# EasyEDA Pro project Stm32Printer.eprj, board PCB4_6
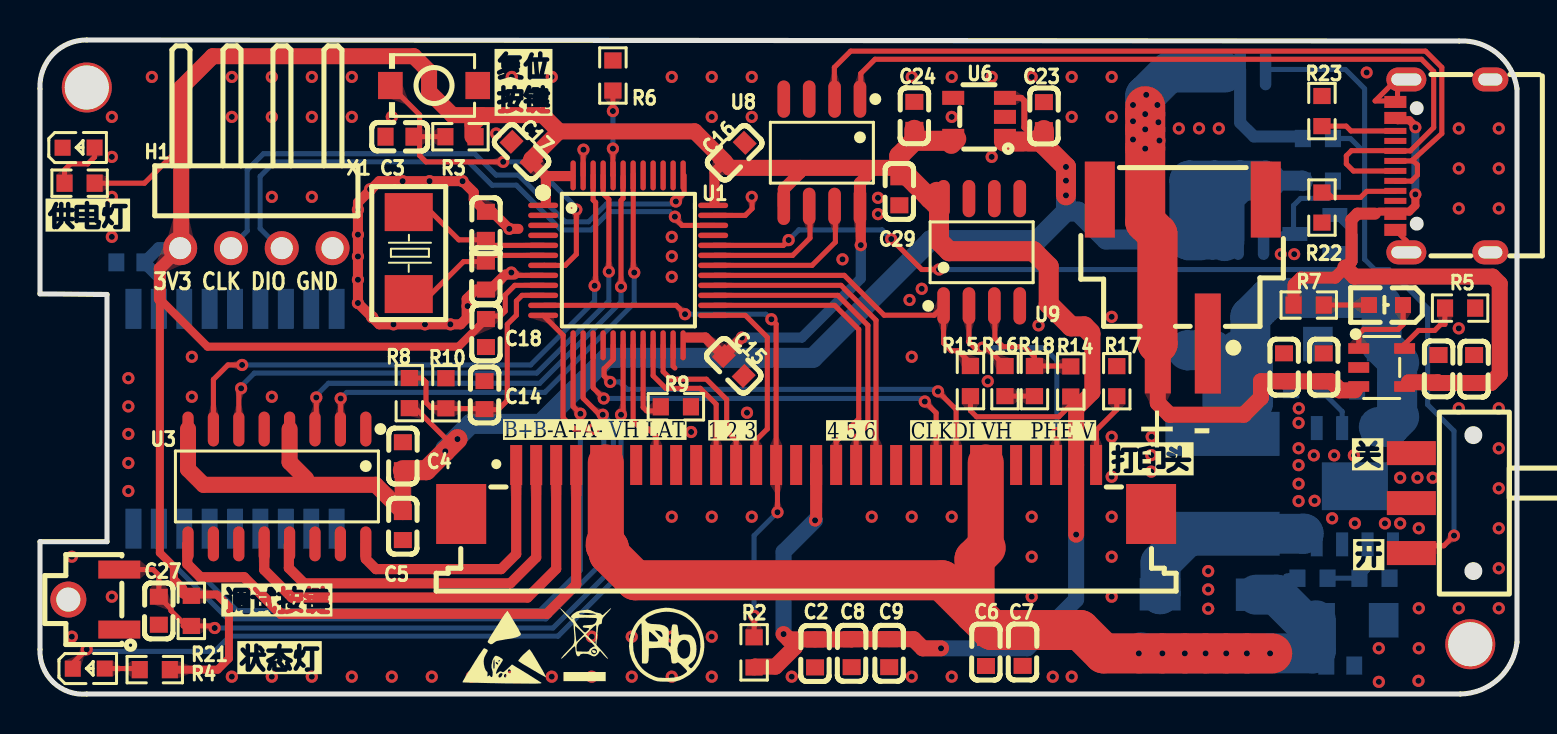
[diagram p2: board, top side]
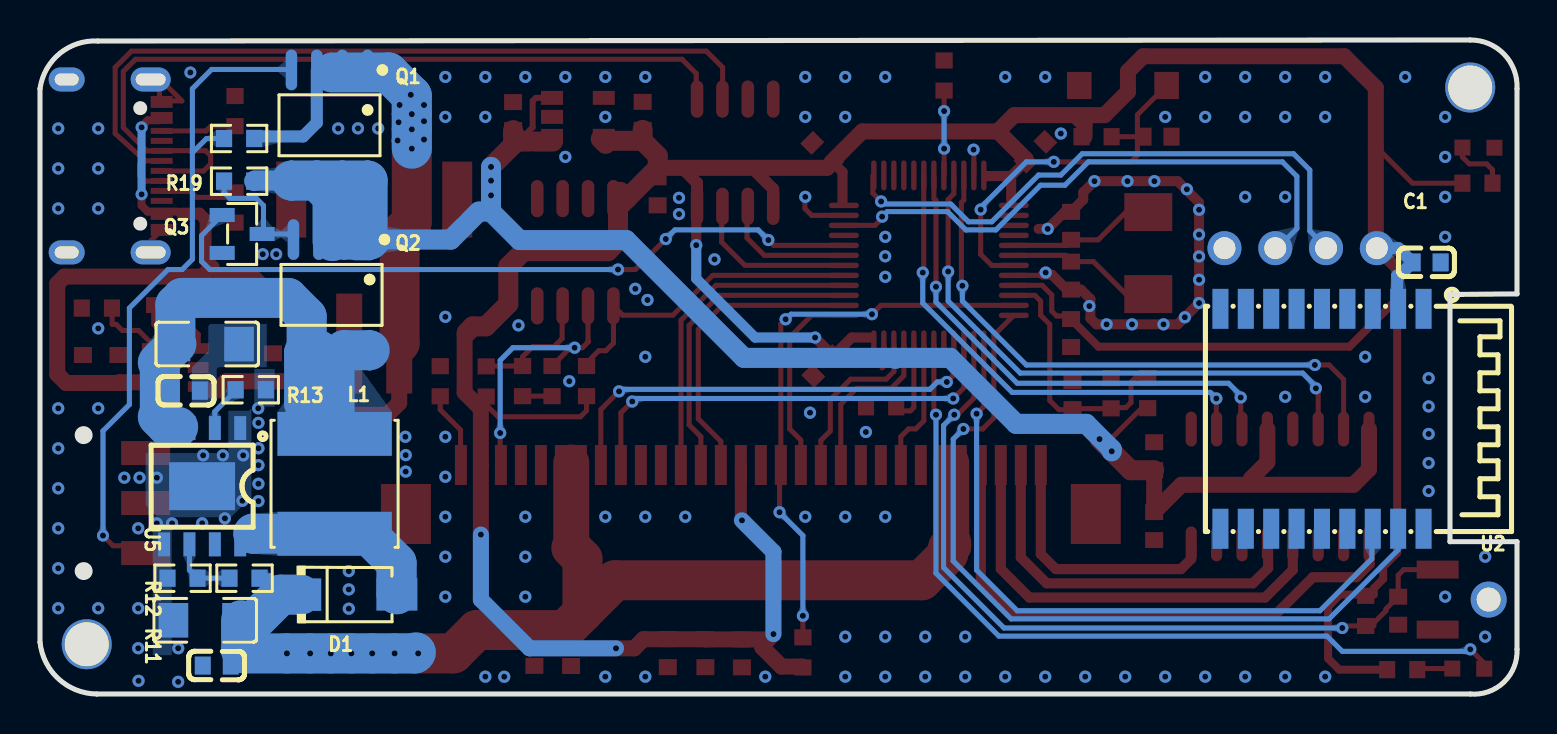
[diagram p3: board, bottom side, seen from below]

Outline 73.86 x 32.72 mm; copper layers: Top Layer, Bottom Layer. Coordinates in mm from the lower left corner of the outline.
Outline path: 0,30.28 0,20.02 3.35,19.98 3.35,7.62 0,7.62 0,2.24 arc(0.66,0.59) 2.34,0 71.02,0 arc(72.93,0.75) 73.86,2.59 73.86,30.28 arc(72.88,32.04) 70.97,32.66 2.35,32.72 arc(0.65,32) 0,30.28
Stack: Top Layer 0.035mm / Dielectric1 1.51mm FR4 er 4.5 / Bottom Layer 0.035mm

## Design rules (mm)
spacing safeClearance (default): track to track 0.127, other pairs 0.152 to 0.3
track width trackWidth (default): min 0.127, default 0.254, max 2.54
differential pair differentialPair (default): width min 0.127, default 0.254, max 2.54; gap min 0.152, default 0.152
via viaSize (default): diameter min 0.5, default 0.61, max 10; hole min 0.3, default 0.305, max 6

## Placement (name value [footprint] x y rotation side)
C1  0.1uF  [c0603]  4.52 21.59 180 bottom
C2  100nF  [C0603]  38.76 2.03 90 top
C3  0.1uF  [c0603]  17.98 27.88 180 top
C4  10uF  [C0603]  18.15 11.9 270 top
C5  100nF  [C0603]  18.15 8.4 90 top
C6  4.7uF  [C0603]  47.31 2.1 90 top
C7  100nF  [C0603]  49.14 2.11 90 top
C8  4.7uF  [C0603]  40.59 2.04 90 top
C9  100nF  [C0603]  42.47 2.04 90 top
C10  10uF  [C0603]  69.94 16.26 270 top
C11  0.1uF  [c0603]  71.72 16.26 90 top
C12  0.1uF  [c0603]  64.19 16.34 270 top
C13  10uF  [C0603]  62.21 16.34 270 top
C14  100nF  [C0603]  22.23 14.95 270 top
C15  0.1uF  [c0603]  34.7 16.41 315 top
C16  0.1uF  [c0603]  34.75 27.08 45 top
C17  0.1uF  [c0603]  24.08 27.13 135 top
C18  0.1uF  [c0603]  22.3 18.06 270 top
C19  47uF  [C1206]  65.5 17.51 0 bottom
C20  100nF  [C0603]  66.57 15.17 0 bottom
C21  47uF  [C1206]  65.6 3.69 180 bottom
C22  100nF  [C0603]  65.02 1.42 180 bottom
C23  1uF  [C0603]  50.2 28.91 270 top
C24  1uF  [C0603]  43.72 28.92 270 top
C25  20pF  [C0603]  22.3 23.42 270 top
C26  20pF  [C0603]  22.3 20.93 90 top
C27  100nF  [C0603]  5.94 4.17 90 top
C29  47uF  [C0603]  42.98 25.15 90 top
D1  SS54  [SMA_L4.3-W2.6-LS5.0-RD]  58.42 4.98 180 bottom
FPC1  XH-2PWB  [CONN-SMD_2P-P2.50_DEALON_XH-2PWB_C2905024]  57.15 21.13 180 top
FPC2  X10B25L30T  [FPC-SMD_X10B25U30T]  38.31 10.23 0 top
H1  PZ254-1-04-W-8.5  [HDR-TH_04P-P2.54-H-M-W10.4-N]  10.82 22.3 180 top
L1  4.7uH  [IND-SMD_L6.0-W6.0]  59.13 10.52 270 bottom
LED1  NCD0603R1  [LED0603-RD_RED]  1.93 27.33 0 top
LED2  TLMG1100-GS08  [LED0603-R-RD_GREEN]  67.31 19.46 180 top
LED3  NCD0603R1  [LED0603-RD_RED]  2.44 1.27 0 top
NOREF  -  [Pad_e221]  71.53 2.49 0 top
NOREF#2  -  [Pad_e104]  2.34 30.34 0 top
Q1  AO4407A  [SOP-8_L5.0-W4.0-P1.27-LS6.0-BL]  59.38 28.45 0 bottom
Q2  AO4407A  [SOP-8_L5.0-W4.0-P1.27-LS6.0-BL]  59.28 19.96 0 bottom
Q3  AO3400A_N  [SOT-23-3_L2.9-W1.3-P1.90-LS2.4-BR]  63.75 23.01 0 bottom
R1  1kΩ  [R0603]  1.98 25.55 180 top
R2  10kΩ  [R0603]  35.71 2.08 270 top
R3  10kΩ  [r0603]  21.03 27.88 0 top
R4  1kΩ  [R0603]  5.74 1.22 180 top
R5  2kΩ  [R0603]  71.02 19.3 180 top
R6  10kΩ  [r0603]  28.65 30.94 90 top
R7  1kΩ  [R0603]  63.45 19.46 0 top
R8  10kΩ  [R0603]  18.47 15.05 270 top
R9  10kΩ  [r0603]  31.8 14.37 0 top
R10  10kΩ  [R0603]  20.3 15.04 270 top
R11  11kΩ  [R0603]  63.64 5.79 180 bottom
R12  1kΩ  [R0603]  66.73 5.79 180 bottom
R13  33kΩ  [R0603]  63.32 15.22 0 bottom
R14  56kΩ  [R0603]  51.55 15.63 270 top
R15  10kΩ  [R0603]  46.53 15.65 90 top
R16  15kΩ  [R0603]  48.26 15.65 90 top
R17  180Ω  [R0603]  53.85 15.65 90 top
R18  24kΩ  [R0603]  49.73 15.65 90 top
R19  100kΩ  [R0603]  63.91 25.65 180 bottom
R20  100kΩ  [R0603]  63.91 27.79 180 bottom
R21  10kΩ  [R0603]  7.57 4.16 270 top
R22  5.1kΩ  [R0603]  64.11 24.33 90 top
R23  5.1kΩ  [R0603]  64.11 29.16 90 top
SW1  TS-1088-AR02016  [SW-SMD_L3.9-W3.0-P4.45]  19.71 30.44 180 top
SW2  TA-3525-A3  [SW-SMD_3P-L9.1-W3.5-P2.50-EH6.8]  68.58 9.55 90 top
SW3  TS4538B3JTP 250gf 121  [KEY-SMD_3P-L4.5-W3.8-P3.00-LS4.5-BL]  2.69 4.72 90 top
U1  STM32F103CBT6  [LQFP-48_L7.0-W7.0-P0.50-LS9.0-BL]  29.41 21.69 270 top
U2  RC6621A  [BULETM-SMD_18P-L15.2-W11.2-P1.27]  9.75 13.77 270 bottom
U3  TC1508S  [SOP-16_L10.0-W3.9-P1.27-LS6.0-BL]  11.85 10.38 180 top
U4  ME4054BM5G-N  [TSOT-23-5_L2.9-W1.6-P0.95-LS2.8-BL]  67.1 16.33 270 top
U5  AP2005SPER  [ESOP-8_L4.9-W3.9-P1.27-LS6.0-BL-EP]  65.75 10.39 0 bottom
U6  XC6210B332MR  [TSOT-23-5_L2.9-W1.6-P0.95-LS2.8-BR]  46.96 28.87 0 top
U8  CH340N  [SOP-8_L4.9-W3.9-P1.27-LS6.0-BL]  39.1 27.08 180 top
U9  LM393ADR  [SOP-8_L4.9-W3.9-P1.27-LS6.0-BL]  47.09 22.1 0 top
USB1  TYPE-C 16PIN 2MD(073)  [USB-C-SMD_TYPE-C-6PIN-2MD-073]  70.15 26.42 90 top
X1  8MHz  [CRYSTAL-SMD_L5.0-W3.2]  18.44 22.06 90 top

## Footprints (pads in the part's own frame, mm; a bottom-side part is the same pattern mirrored in y, then rotated)
BULETM-SMD_18P-L15.2-W11.2-P1.27
  rect 2x0.8 smd: 1(-5.5,5.08) 2(-5.5,3.81) 3(-5.5,2.54) 4(-5.5,1.27) 5(-5.5,0) 6(-5.5,-1.27) 7(-5.5,-2.54) 8(-5.5,-3.81) 9(-5.5,-5.08) 10(5.5,-5.08) 11(5.5,-3.81) 12(5.5,-2.54) 13(5.5,-1.27) 14(5.5,0) 15(5.5,1.27) 16(5.5,2.54) 17(5.5,3.81) 18(5.5,5.08)
C0603
  rect 0.8x0.9 smd: 1(-0.7,0) 2(0.7,0)
c0603
  rect 0.8x0.9 smd: 1(-0.7,0) 2(0.7,0)
C1206
  rect 1.485x1.728 smd: 1(-1.593,0) 2(1.593,0)
CONN-SMD_2P-P2.50_DEALON_XH-2PWB_C2905024
  rect 1.3x5 smd: 1(-1.25,3.6) 2(1.25,3.6)
  rect 1.5x3.8 smd: 3(-4.15,-3.6) 4(4.15,-3.6)
CRYSTAL-SMD_L5.0-W3.2
  rect 1.9x2.4 smd: 1(-2.05,0) 2(2.05,0)
ESOP-8_L4.9-W3.9-P1.27-LS6.0-BL-EP
  rect 0.6x1.2 smd: 1(-1.905,-2.909) 2(-0.635,-2.909) 3(0.635,-2.909) 4(1.905,-2.909) 5(1.905,2.909) 6(0.635,2.909) 7(-0.635,2.909) 8(-1.905,2.909)
  rect 3.3x2.4 smd: 9(0,0)
FPC-SMD_X10B25U30T
  rect 0.6x2 smd: 1(-14.5,1.225) 2(-13.5,1.225) 3(-12.5,1.225) 4(-11.5,1.225) 5(-10.5,1.225) 6(-9.5,1.225) 7(-8.5,1.225) 8(-7.5,1.225) 9(-6.5,1.225) 10(-5.5,1.225) 11(-4.5,1.225) 12(-3.5,1.225) 13(-2.5,1.225) 14(-1.5,1.225) 15(-0.5,1.225) 16(0.5,1.225) 17(1.5,1.225) 18(2.5,1.225) 19(3.5,1.225) 20(4.5,1.225) 21(5.5,1.225) 22(6.5,1.225) 23(7.5,1.225) 24(8.5,1.225) 25(9.5,1.225) 26(10.5,1.225) 27(11.5,1.225) 28(12.5,1.225) 29(13.5,1.225) 30(14.5,1.225)
  rect 2.5x3 smd: 31(17.25,-1.225) 32(-17.25,-1.225)
HDR-TH_04P-P2.54-H-M-W10.4-N
  round 1.7 hole 1.1: 1(-3.81,0) 2(-1.27,0) 3(1.27,0) 4(3.81,0)
IND-SMD_L6.0-W6.0
  rect 2.2x5.72 smd: 1(-2.5,0) 2(2.5,0)
KEY-SMD_3P-L4.5-W3.8-P3.00-LS4.5-BL
  rect 0.9x2.1 smd: 1(-1.5,-1.274) 2(1.5,-1.274)
  round 1.8 hole 1.2: 3(0,1.274)
LED0603-R-RD_GREEN
  rect 0.8x0.8 smd: 1(0.851,0) 2(-0.851,0)
LED0603-RD_RED
  rect 0.8x0.8 smd: 1(-0.799,-0.004) 2(0.799,0.004)
LQFP-48_L7.0-W7.0-P0.50-LS9.0-BL
  oval 0.27x1.5 smd: 1(-2.75,-4.25) 2(-2.25,-4.25) 3(-1.75,-4.25) 4(-1.25,-4.25) 5(-0.75,-4.25) 6(-0.25,-4.25) 7(0.25,-4.25) 8(0.75,-4.25) 9(1.25,-4.25) 10(1.75,-4.25) 11(2.25,-4.25) 12(2.75,-4.25) 25(2.75,4.25) 26(2.25,4.25) 27(1.75,4.25) 28(1.25,4.25) 29(0.75,4.25) 30(0.25,4.25) 31(-0.25,4.25) 32(-0.75,4.25) 33(-1.25,4.25) 34(-1.75,4.25) 35(-2.25,4.25) 36(-2.75,4.25)
  oval 1.5x0.27 smd: 13(4.25,-2.75) 14(4.25,-2.25) 15(4.25,-1.75) 16(4.25,-1.25) 17(4.25,-0.75) 18(4.25,-0.25) 19(4.25,0.25) 20(4.25,0.75) 21(4.25,1.25) 22(4.25,1.75) 23(4.25,2.25) 24(4.25,2.75) 37(-4.25,2.75) 38(-4.25,2.25) 39(-4.25,1.75) 40(-4.25,1.25) 41(-4.25,0.75) 42(-4.25,0.25) 43(-4.25,-0.25) 44(-4.25,-0.75) 45(-4.25,-1.25) 46(-4.25,-1.75) 47(-4.25,-2.25) 48(-4.25,-2.75)
Pad_e104
  round 2.5 hole 2.2: 25(0,0)
Pad_e221
  round 2.5 hole 2.2: 23(0,0)
R0603
  rect 0.806x0.864 smd: 1(-0.753,0) 2(0.753,0)
r0603
  rect 0.806x0.864 smd: 1(-0.753,0) 2(0.753,0)
SMA_L4.3-W2.6-LS5.0-RD
  rect 2.046x1.62 smd: 1(-2.404,-0.009) 2(2.404,0.009)
SOP-8_L4.9-W3.9-P1.27-LS6.0-BL
  oval 0.63x1.865 smd: 1(-1.905,-2.683) 2(-0.635,-2.683) 3(0.635,-2.683) 4(1.905,-2.683) 5(1.905,2.683) 6(0.635,2.683) 7(-0.635,2.683) 8(-1.905,2.683)
SOP-8_L5.0-W4.0-P1.27-LS6.0-BL
  oval 0.574x2.035 smd: 1(-1.905,-2.768) 2(-0.635,-2.768) 3(0.635,-2.768) 4(1.905,-2.768) 5(1.905,2.768) 6(0.635,2.768) 7(-0.635,2.768) 8(-1.905,2.768)
SOP-16_L10.0-W3.9-P1.27-LS6.0-BL
  oval 0.56x1.745 smd: 1(-4.445,-2.873) 2(-3.175,-2.873) 3(-1.905,-2.873) 4(-0.635,-2.873) 5(0.635,-2.873) 6(1.905,-2.873) 7(3.175,-2.873) 8(4.445,-2.873) 9(4.445,2.873) 10(3.175,2.873) 11(1.905,2.873) 12(0.635,2.873) 13(-0.635,2.873) 14(-1.905,2.873) 15(-3.175,2.873) 16(-4.445,2.873)
SOT-23-3_L2.9-W1.3-P1.90-LS2.4-BR
  rect 1.25x0.7 smd: 1(1,-0.95) 2(1,0.95) 3(-1,0)
SW-SMD_3P-L9.1-W3.5-P2.50-EH6.8
  rect 1.2x2.45 smd: 1(-2.5,0) 2(0,0) 3(2.5,0)
SW-SMD_L3.9-W3.0-P4.45
  rect 1.23x1.36 smd: 1(-2.185,0) 2(2.185,0)
TSOT-23-5_L2.9-W1.6-P0.95-LS2.8-BL
  rect 0.532x1.045 smd: 1(-0.95,-1.147) 2(0,-1.147) 3(0.95,-1.147) 4(0.95,1.147) 5(-0.95,1.147)
TSOT-23-5_L2.9-W1.6-P0.95-LS2.8-BR
  rect 1.1x0.7 smd: 1(1.294,-0.951) 2(1.294,-0.001) 3(1.294,0.951) 4(-1.294,0.951) 5(-1.294,-0.949)
USB-C-SMD_TYPE-C-6PIN-2MD-073
  rect 0.6x1.1 smd: 1(-3.2,2.375) 2(-2.4,2.375) 11(2.4,2.375) 12(3.2,2.375)
  rect 0.3x1.1 smd: 3(-1.75,2.375) 4(-1.25,2.375) 5(-0.75,2.375) 6(-0.25,2.375) 7(0.25,2.375) 8(0.75,2.375) 9(1.25,2.375) 10(1.75,2.375)
  oval 1.2x2 hole 0.6x1.5: 13(-4.325,1.825) 14(4.325,1.825)
  oval 1.2x1.8 hole 0.6x1.2: 13(-4.325,-2.375) 14(4.325,-2.375)

## Nets
As in the schematic.

Pads without a net: FPC1 3 4; FPC2 7 26 27 31 32; NOREF 23; NOREF#2 25; SW2 3; SW3 3; U1 2 3 4 16 33 38 39 40 41; U2 3 4 5 6 7 8 9 10 11 12 13 14 15 18; U3 1 5; U5 7; U6 4; U8 4; U9 5 6 7; USB1 3 9

## Via types
v1: diameter 0.61, hole 0.304, Top Layer to Bottom Layer, 106 vias
v2: diameter 0.61, hole 0.305, Top Layer to Bottom Layer, 95 vias
v3: diameter 0.6, hole 0.305, Top Layer to Bottom Layer, 26 vias

## Routing (per net, layer and track width the routed paths; a pad name or vN(x,y) marks a point on that pad's centre or on a via; arc(x,y) is an arc through that point)
3V3: length 201.8
  Top Layer w0.254: 22.3,18.91 23.02,18.91 23.27,19.15 23.27,19.96 23.74,20.44 25.21,20.44 ; 7.06,27.39 5.22,25.55 R1.1 ; 51.82,14.73 50.95,13.87 46.84,13.87 46.53,14.17 R15.1
  Top Layer w0.4: C18.1 22.3,18.75 20.93,17.37 8.38,17.37 5.99,19.76 5.99,7.06 6.7,6.36 6.7,5.75 7.16,5.28 7.16,4.97 8.84,4.97 9.45,4.37 9.45,1.78 8.89,1.22 R4.1
  Top Layer w0.508: v2(41.05,22.45) 41.05,24.35 U8.8 ; 33.73,24.64 33.73,26.11 34.25,26.63 ; 25.3,25.91 26.52,25.91 ; 25.3,25.91 25.3,24.64 ; 25.3,25.91 C17.1 ; v2(35.1,17.83) 34.2,16.93 C15.1 33.27,17.83 32.36,17.83
  Top Layer w0.6: 5.99,19.76 5.99,21.29 H1.4 ; 51.82,14.27 51.82,14.73 ; 41.55,26.11 41.01,25.56 U8.8 ; 38.01,26.32 38.01,26.08 37.2,25.26 U8.5 ; v2(38.76,8.69) 38.81,8.74 FPC2.16
  Top Layer w0.8: v2(51.82,7.98) FPC2.29 ; 34.25,26.63 32.74,28.14 25.96,28.14 ; R2.2 35.75,1.37 36.78,1.37 37.74,2.34 37.74,2.44 ; 22.1,28.96 20.62,28.96 19.46,30.12 19.46,31.14 18.69,31.9 8.64,31.9 7.06,30.33 7.06,22.05 ; 22.1,28.96 21.63,28.49 21.63,27.88 ; 22.1,28.96 25.15,28.96 25.96,28.14 ; v2(37.19,3) 37.45,2.73 C2.2 40.58,2.73 C8.2 C9.2 43.69,2.74 44.15,2.29 v2(45.06,2.29) ; 52.53,18.08 52.63,17.98 52.63,15.08 51.82,14.27 51.82,11.46 ; 42.97,26.32 34.51,26.32 C16.1 ; C17.1 24.57,26.76 25.96,28.14
  Top Layer w1: 43.72,27.67 42.97,26.92 42.97,26.32 44.51,24.78 ; 43.72,27.67 45.42,27.67 ; 43.72,27.67 C24.2 ; 44.51,24.78 44.85,25.12 ; 44.51,24.78 44.96,24.33 44.96,22.66 45.47,22.15 49.68,22.15 50.44,21.39 50.44,19.51 51.56,18.39 52.22,18.39 52.53,18.08 ; 45.82,27.77 45.57,27.52
  Bottom Layer w0.508: v2(41.05,22.45) 41.05,20.78 38.1,17.83 v2(35.1,17.83)
  Bottom Layer w0.6: H1.4 5.93,22.3 C1.1 5.88,20.93 5.99,20.93 5.99,19.32 U2.2
  Bottom Layer w0.8: v2(38.76,8.69) 37.19,7.11 v2(37.19,3) ; v2(51.82,7.98) 51.82,4.72 49.38,2.29 v2(45.06,2.29)
GND: length 37.8
  Top Layer w0.254: U1.47 27.16,27.21 v2(27.18,27.23) ; v1(35.59,24.87) 35.61,24.85 35.61,24.28 35.27,23.94 U1.35 ; 23.72,20.98 23.76,20.94 U1.8 ; 31.75,16.31 31.66,16.39 U1.23 ; USB1.1 68.33,22.67 USB1.13 ; R18.1 R16.1 ; 66.77,29.67 67.89,30.79 67.89,29.72 USB1.12 67.73,29.67 66.77,29.67
  Top Layer w0.5: 23.93,23.27 v2(23.47,23.27) 22.62,24.12 C25.1 21.69,24.73 21.69,25.1 v2(21.13,25.65) v2(19.48,25.65) v2(18.14,25.65) 16.97,25.65 15.9,24.59 v2(15.9,24.22) v2(15.9,22.98) v2(15.9,21.89) v2(15.9,20.72) v2(15.9,19.56) v2(16.61,18.85) 16.97,18.49 v2(17.68,18.49) v2(19.25,18.49) v2(20.52,18.49) 21.03,18.49 21.34,18.8 21.34,19.76 21.8,20.23 22.52,20.23 23.27,20.98 23.72,20.98
  vias: v1(1.59,6.87) v1(1.59,2.87) v1(3.59,28.87) v1(3.59,26.87) v1(3.59,24.87) v1(3.59,22.87) v1(3.59,4.87) v1(5.59,30.87) v1(7.59,16.87) v1(7.59,14.87) v1(9.59,30.87) v1(9.59,28.87) v1(9.59,0.87) v1(11.59,30.87) v1(11.59,28.87) v1(11.59,24.87) v1(11.59,14.87) v1(11.59,0.87) v1(13.59,30.87) v1(13.59,28.87) v1(13.59,24.87) v1(13.59,0.87) v1(15.59,30.87) v1(15.59,28.87) v1(15.59,0.87) v1(17.59,28.87) v1(17.59,0.87) v1(19.59,0.87) v1(21.59,0.87) v1(23.59,30.87) v1(23.59,0.87) v1(25.59,30.87) v1(25.59,0.87) v1(27.59,2.87) v1(27.59,0.87) v1(29.59,2.87) v1(29.59,0.87) v1(31.59,30.87) v1(31.59,22.87) v1(31.59,20.87) v1(31.59,8.87) v1(31.59,2.87) v1(31.59,0.87) v1(33.59,30.87) v1(33.59,28.87) v1(33.59,8.87) v1(33.59,2.87) v1(33.59,0.87) v1(35.59,30.87) v1(35.59,28.87) v1(35.59,8.87) v1(37.59,0.87) v1(41.59,8.87) v1(43.59,30.87) v1(43.59,16.87) v1(43.59,8.87) v1(43.59,0.87) v1(45.59,30.87) v1(45.59,28.87) v1(45.59,8.87) v1(45.59,0.87) v1(47.59,30.87) v1(47.59,26.87) v1(49.59,30.87) v1(49.59,8.87) v1(49.59,6.87) v1(49.59,4.87) v1(51.59,30.87) v1(51.59,28.87) v1(51.59,0.87) v1(53.59,30.87) v1(53.59,28.87) v1(53.59,18.87) v1(53.59,12.87) v1(53.59,10.87) v1(53.59,8.87) v1(53.59,6.87) v1(53.59,4.87) v1(55.59,12.87) v1(56.95,28.29) v1(57.96,28.3) v1(58.42,6.15) v1(58.42,5.23) v1(58.42,4.27) v1(58.95,28.29) v1(62.95,14.29) v1(66.95,2.29) v1(68.95,4.29) v1(68.95,2.29) v1(70.95,28.29) v1(70.95,26.29) v1(70.95,24.29) v1(70.95,18.29) v1(70.95,14.29) v1(70.95,4.29) v1(72.95,28.29) v1(72.95,26.29) v1(72.95,24.29) v1(72.95,14.29) v1(72.95,12.29) v1(72.95,10.29) v1(72.95,8.29) v1(72.95,6.29) v1(72.95,4.29) v2(4.42,15.8) v2(4.42,14.39) v2(4.42,13.01) v2(4.42,11.56) v2(4.42,10.15) v2(16.51,25.25) v2(21.39,19.41) v2(22.81,28.04) v2(23.57,21.08) v2(31.6,21.89) v2(32.56,13.11) v2(35.36,14.07) v2(40.13,21.74) v2(41.91,24.82) v2(41.91,24.01) v2(43.48,19.71) v2(44.09,20.27) v2(47.4,15.65) v2(49.94,18.44) v2(50.65,0.86) v2(55.57,11.95) v2(55.57,11.13) v2(62.94,13.56) v2(62.94,12.29) v2(62.94,11.45) v2(62.94,10.52) v2(62.94,9.65) v2(63.7,11.94) v2(63.74,9.67) v2(64.62,8.79) v2(64.72,11.94) v2(65.71,11.94) v2(65.75,8.54) v2(66.95,0.61) v2(67.26,8.53) v2(68.02,10.82) v2(68.02,8.53) v2(68.88,10.82) v2(68.94,0.66) v2(69.65,10.82) v3(62.05,22) v3(62.72,22) v3(66.34,31.09)
VBAT: length 40.4
  Top Layer w0.254: 55.27,29.92 v3(55.32,29.97)
  Top Layer w0.8: 65.75,15.19 64.97,15.19 64.97,15.24 64.57,15.64 C12.2 62.8,15.64 ; FPC1.2 55.9,14.56 56.49,13.97 60.2,13.97 61.06,14.83 61.06,15.65 62.79,15.65 62.8,15.64 ; 62.8,15.64 C13.2
  Top Layer w2: FPC1.2 55.88,17.55 55.88,23.01 55.27,23.62 v3(55.27,27.28) v3(55.27,28.24) v3(55.27,29.01) 55.27,29.4
  Bottom Layer w0.6: Q1.3 60.02,28.58 60.71,27.89 63.05,27.89 R20.2
  Bottom Layer w2: v3(55.27,27.28) v3(55.27,28.24) v3(55.27,29.01) 55.27,29.92 v3(55.32,29.97) 56.44,31.09 59.24,31.09
  vias: v3(54.66,29.46) v3(54.66,28.65) v3(54.66,27.74) v3(55.88,29.46) v3(55.93,28.6) v3(55.98,27.69)
VBAT_OUT: length 93.9
  Top Layer w0.254: R8.2 18.77,14.3 20.32,12.75 v2(20.88,12.75)
  Top Layer w0.3: 48.26,29.82 49.07,29.82 49.22,29.67 49.22,28.35 49.94,27.64
  Top Layer w0.8: 13.31,10.77 12.48,11.6 U3.4 ; C4.2 18.15,9.1 16.78,10.47 8.18,10.47 7.4,11.24 U3.8
  Top Layer w1: 49.43,27.64 49.94,27.64 ; C4.2 19.32,11.19 v2(20.27,12.14) v2(20.88,12.75) ; 50.2,28 49.94,27.74 ; 50.2,28 50.2,27.47 v3(51.31,26.37) v3(51.31,25.68) v3(51.31,24.94) ; 50.2,28 C23.2 ; 49.17,27.64 48.21,27.64
  Bottom Layer w0.5: 57.56,25.76 Q1.8
  Bottom Layer w0.8: Q2.1 57.38,22.1 58.12,22.1
  Bottom Layer w1: 31.14,16.81 31.09,16.76 ; 31.14,16.81 28.35,16.81 25.04,13.51 21.54,13.51 20.27,12.24 v2(20.27,12.14) ; 31.14,16.81 38.66,16.81 44.55,22.71 49.89,22.71 51.31,24.13 ; 51.31,24.13 v3(51.31,24.94) v3(51.31,25.68) v3(51.31,26.37) ; 51.31,24.13 51.92,24.13 53.32,22.73 Q2.1 ; Q1.5 63.13,25.68 R19.2
  Bottom Layer w2: Q1.6 Q1.5 ; Q1.6 Q1.7 Q1.8 57.48,22.83 Q2.1 58.65,22.73 ; Q1.6 58.88,24.54 ; 59.23,24.59 59.23,22.66
VBUS: length 32.2
  Top Layer w0.4: USB1.11 67.89,28.7 68.48,28.7 68.78,28.4 v3(68.78,28.35) ; 66.96,24.13 68.48,24.13 68.78,24.44 v3(68.78,24.99)
  Top Layer w0.6: R7.1 62.7,20.48 63.04,20.83 64.77,20.83 65.28,21.34 65.58,21.64 65.58,23.72 65.89,24.03 66.76,24.03
  Top Layer w0.8: 65.28,21.34 65.73,20.88 72.64,20.88 73,20.52 73,16 72.55,15.56 C11.1 C10.2 69.9,15.6 68.45,15.6
  Bottom Layer w0.4: v3(68.78,24.99) v3(68.78,28.35)
VCC_IN: length 27.1
  Bottom Layer w2: Q2.6 60.53,17.2 ; 60.53,17.2 60.53,18.87 61.47,19.81 66.75,19.81 67.09,19.47 C19.2 ; 60.53,17.2 60.66,17.07 60.66,14.54 L1.1 59.13,16.71 58.65,17.2 Q2.8 ; 66.95,13.36 67.46,13.36 67.97,13.87 ; 67.04,17.51 67.97,16.58 ; 67.87,16.58 67.87,13.87
(no net):
  vias: v1(68.95,8.29)
BLE_RX: length 40
  Top Layer w0.254: U1.12 26.16,17.94 26.16,13.82 26.72,13.26 v2(27.69,13.26)
  Bottom Layer w0.254: U2.17 5.94,7.21 9.4,3.76 25.3,3.76 28.19,6.66 28.19,12.75 v2(27.69,13.26)
BLE_TX: length 34.6
  Top Layer w0.254: v2(27.03,14.02) 26.66,14.38 U1.13
  Bottom Layer w0.254: v2(27.03,14.02) 27.03,6.2 24.99,4.17 9.85,4.17 7.26,6.76 7.26,8.22 U2.16
BOOT0: length 3.9
  Top Layer w0.254: v2(28.65,29.16) 28.65,29.84 ; U1.44 28.65,25.95 v2(28.65,27.28)
  Bottom Layer w0.254: v2(28.65,29.16) v2(28.65,27.28)
BOOT1: length 4.1
  Top Layer w0.254: 31.05,14.16 30.34,14.16 30.16,14.34 U1.20
BTN: length 40
  Top Layer w0.254: 3.87,6.22 5.66,6.22 5.94,5.94 C27.2 6.55,4.26 6.55,4.17 7.16,3.56 7.16,3.4 8.63,3.4 v2(8.74,3.3) ; U1.14 27.16,14.8 28.09,13.87 28.09,13.92 v2(28.14,13.97)
  Bottom Layer w0.254: v2(28.14,13.97) 28.68,13.44 28.68,6.33 25.65,3.3 v2(8.74,3.3)
CH340_RX: length 8.3
  Top Layer w0.254: 33.71,21.44 38.61,21.44 39.78,22.61 39.78,24.35 U8.7
CH340_TX: length 6.8
  Top Layer w0.254: U8.6 38.51,24.35 38.51,22.81 37.64,21.94 33.71,21.94
CLK: length 22.4
  Top Layer w0.254: v2(44.25,14.63) 44.81,14.06 FPC2.22 ; U1.15 27.66,15.31 v2(28.19,14.78)
  Bottom Layer w0.254: v2(44.25,14.63) 44.09,14.78 v2(28.19,14.78)
DI: length 22.8
  Top Layer w0.254: v2(44.91,15.14) 45.81,14.23 FPC2.23 ; U1.17 28.66,16.72 28.21,16.27 28.21,15.91 v2(28.52,15.61)
  Bottom Layer w0.254: v2(44.91,15.14) 44.81,15.24 29.36,15.24 28.99,15.61 v2(28.52,15.61)
IN1: length 29.5
  Top Layer w0.254: v2(27.74,20.42) 27.79,20.47 27.79,24.59 27.66,24.71 U1.46 ; v2(10.11,16.46) 9.4,16.46 8.67,15.73 U3.7
  Bottom Layer w0.254: v2(27.74,20.42) 27.74,19.66 24.54,16.46 v2(10.11,16.46)
IN2: length 28.7
  Top Layer w0.254: v2(28.45,21.13) 28.45,24.74 28.16,25.02 U1.45 ; v2(10.06,15.29) 9.94,15.18 U3.6
  Bottom Layer w0.254: v2(28.45,21.13) 28.45,19.66 24.84,16.05 10.72,16.05 10.06,15.39 v2(10.06,15.29)
IN3: length 25.2
  Top Layer w0.254: v2(13.82,14.83) 13.82,13.32 U3.3 ; 29.16,25.89 29.16,24.79 29.06,24.69 v2(29.06,20.37)
  Bottom Layer w0.254: v2(29.06,20.37) 29.06,19.61 24.99,15.55 14.43,15.55 13.82,14.94 v2(13.82,14.83)
IN4: length 24.6
  Top Layer w0.254: v2(29.72,21.08) 29.67,21.13 29.67,25.99 ; U3.2 15.04,13.27 v2(15.04,14.78)
  Bottom Layer w0.254: v2(15.04,14.78) 15.34,15.09 25.25,15.09 29.72,19.56 v2(29.72,21.08)
LAT: length 6.7
  Top Layer w0.254: FPC2.8 30.81,12.87 30.43,13.26 30.07,13.26 29.66,13.67 U1.19
LED: length 41.1
  Top Layer w0.254: LED3.1 1.64,1.54 v2(2.34,2.24) ; U1.18 29.16,14.08 v2(29.06,13.97)
  Bottom Layer w0.254: v2(29.06,13.97) 29.06,6.05 25.91,2.9 9.5,2.9 8.74,2.13 2.44,2.13 v2(2.34,2.24)
M_A+: length 22.3
  Top Layer w0.508: FPC2.3 25.81,6.26 24.38,4.83 12.6,4.83 11.21,6.21 U3.12
M_A-: length 28.1
  Top Layer w0.508: U3.9 7.37,7.47 7.37,6.5 8.03,5.84 10.21,5.84 12.04,4.01 25.35,4.01 26.81,5.48 FPC2.4
M_B+: length 13.3
  Top Layer w0.508: FPC2.1 23.81,7 23.06,6.25 16.8,6.25 16.29,6.76 U3.16
M_B-: length 19.1
  Top Layer w0.508: U3.13 12.45,7.47 12.45,6.3 13.21,5.54 23.52,5.54 24.81,6.83 FPC2.2
NRST: length 18.3
  Top Layer w0.254: SW1.2 18.98,28.98 18.98,27.88 ; 18.98,27.88 20.12,27.88 20.12,27.88 ; 18.98,27.88 18.98,26.94 19.3,26.62 v2(23.16,26.62) ; 25.21,21.44 25.22,21.44 26.26,21.44 26.82,22 v2(26.82,24.23)
  Bottom Layer w0.254: v2(26.82,24.23) 26.82,24.33 24.54,26.62 v2(23.16,26.62)
OSC_IN: length 6.3
  Top Layer w0.254: C25.2 20.94,22.72 19.56,24.11 ; 25.21,22.44 22.53,22.44 22.3,22.67
OSC_OUT: length 6.4
  Top Layer w0.254: 19.56,20.01 21.18,21.63 C26.2 ; 25.21,21.94 22.56,21.94 22.3,21.68
PHE: length 13.4
  Top Layer w0.254: U9.2 46.46,17.65 46.43,17.63 46.74,17.32 47.34,17.32 R16.2 ; FPC2.28 50.85,11.49 v2(50.85,13.06)
  Bottom Layer w0.254: v2(50.85,13.06) 50.85,16.69 50.22,17.32 v2(47.13,17.32)
PHINT: length 16.3
  Top Layer w0.254: 33.71,20.94 40.22,20.94 42.21,18.95 44.72,18.95 U9.1 45.19,17.55 45.57,17.17 45.92,17.17 46.53,16.56 R15.2
POWER_ADC: length 13
  Top Layer w0.254: 25.21,19.94 24.11,19.94 23.82,19.66 23.82,18.95 23.37,18.49 23.37,14.68 22.91,14.22 22.36,14.22 22.31,14.27 20.32,14.27 R10.2 20.26,14.33 19.56,14.33 19.3,14.58 19.3,15.6 19.09,15.81 R8.1
STB1: length 8.3
  Top Layer w0.254: U1.21 30.66,15.92 31.29,15.29 33.02,15.29 33.81,14.5 FPC2.11
STB2: length 8.5
  Top Layer w0.254: FPC2.12 34.81,12.68 34.34,13.16 34.34,14.73 33.32,15.75 31.55,15.75 31.16,16.13 U1.22
STB3: length 9.7
  Top Layer w0.254: 33.71,18.94 35.28,18.94 36.37,17.85 36.37,13.26 35.81,12.7 FPC2.13
STB4: length 15
  Top Layer w0.254: FPC2.17 39.81,12.64 40.94,13.77 40.94,18.24 39.74,19.44 33.71,19.44
STB5: length 15.5
  Top Layer w0.254: FPC2.18 40.81,12.88 41.4,13.46 41.4,18.44 39.9,19.94 33.71,19.94
STB6: length 16.1
  Top Layer w0.254: 33.71,20.44 40.06,20.44 41.81,18.69 41.81,11.46 FPC2.19
SWCLK: length 29.4
  Top Layer w0.254: v2(31.8,24.64) 32.21,25.05 32.21,25.94
  Bottom Layer w0.254: v2(31.8,24.64) 31.67,24.51 28.32,24.51 27.43,23.62 26.26,23.62 23.93,25.96 22.81,25.96 21.74,27.03 11.18,27.03 10.36,26.21 10.36,23.16 9.5,22.3 9.4,22.3
SWDIO: length 29.1
  Top Layer w0.254: 33.71,23.44 32.11,23.44 31.75,23.8 v2(31.75,23.88)
  Bottom Layer w0.254: v2(31.75,23.88) 31.5,24.13 28.48,24.13 27.56,23.22 26.06,23.22 23.82,25.45 22.61,25.45 21.44,26.62 11.73,26.62 11.01,25.89 11.01,23.28 11.94,22.35 11.94,22.3
THER: length 28.2
  Top Layer w0.254: R2.1 v2(35.71,3.91) ; v2(36.88,9.09) 36.88,11.39 FPC2.14 36.81,18.51 v2(36.58,18.75) ; v2(32.26,19) 31.82,19.44 25.21,19.44
  Bottom Layer w0.254: v2(32.26,19) 36.3,19 36.55,18.75 v2(36.58,18.75) ; v2(36.88,9.09) 35.71,7.92 v2(35.71,3.91)
UD+: length 41.3
  Top Layer w0.254: U8.1 41.05,29.8 41.05,31.04 41.76,31.75 69.09,31.75 69.7,31.14 69.7,28.34 68.53,27.17 68.15,27.17 68.14,27.18 65.58,27.18 65.33,26.92 65.33,26.52 65.68,26.16 67.78,26.16 USB1.6
UD-: length 40.9
  Top Layer w0.254: USB1.5 67.79,25.65 68.58,25.65 68.88,25.96 68.88,26.47 68.64,26.71 ; USB1.7 68.6,26.67 68.64,26.71 ; 68.64,26.71 70.1,28.04 70.1,31.34 69.29,32.16 40.54,32.16 39.73,31.34 39.73,29.77 U8.2
VH: length 61.2
  Top Layer w1.8: 28.3,7.57 28.3,11.58 ; 47.29,7.32 47.29,11.58
  Top Layer w2: 47.29,7.32 46.74,6.76 46.74,4.06 ; 46.74,4.06 47.6,3.2 52.02,3.2 53.19,2.03 v3(54.95,2.03) v3(56.13,2.03) v3(57.25,2.03) v3(58.29,2.03) v3(59.32,2.03) v3(60.35,2.03) 61.62,2.03 ; 46.74,4.06 45.11,5.69 29.77,5.69 28.45,7.01 28.45,7.32 28.35,7.42 28.3,7.42 28.3,7.57
  Bottom Layer w0.5: R11.2 62.38,5.79
  Bottom Layer w2: 63.04,3.76 61.83,4.97 D1.1 ; 63.81,3.69 63.81,2.19 63.65,2.03 v3(61.52,2.03) v3(60.35,2.03) v3(59.32,2.03) v3(58.29,2.03) v3(57.25,2.03) v3(56.13,2.03) 55.12,2.03 55.07,2.08
VH_EN: length 36.2
  Top Layer w0.254: v2(44.96,21.23) 44.09,21.23 v2(42.57,22.76) ; v2(37.44,22.71) 37.17,22.44 U1.32
  Bottom Layer w0.254: Q3.1 65.79,22.93 65.79,21.64 65.38,21.23 v2(44.96,21.23) ; v2(42.57,22.76) 42.11,23.22 37.95,23.22 v2(37.44,22.71)
$1N47791: length 6.3
  Top Layer w0.254: R14.1 51.53,16.41 R18.2 49.73,16.87 49.22,17.37 48.16,17.37 47.75,17.78 47.75,19.39 U9.3
$1N163268: length 3.9
  Top Layer w0.254: 53.85,14.94 53.85,14.22 52.83,13.21 52.83,11.47 FPC2.30
$1N171056: length 2.9
  Top Layer w0.254: R1.2 1.23,26.22 1.52,26.52 2.39,26.52 2.73,26.86 LED1.2
$1N228514: length 5.9
  Bottom Layer w0.254: 62.62,23.01 61.47,23.01 Q2.4 ; 62.62,23.01 Q3.3 ; 62.62,23.01 62.69,23.08 62.69,24.44 63.04,24.79 64.36,24.79 64.66,25.09 R19.1
$1N228520: length 3.5
  Bottom Layer w0.254: R11.1 R12.2 66.39,6.2 U5.6
$1N228523: length 2.3
  Bottom Layer w0.254: U5.2 65.12,14.13 64.08,15.17 R13.2
$1N228526: length 9.3
  Bottom Layer w2: 63.19,8.03 63.18,8.02 L1.2 57.49,8.02 56.03,6.55 56.03,5 D1.2
$1N229607: length 3.5
  Top Layer w0.254: R5.2 70.26,19.3 70.26,18.49 70.05,18.49 69.75,18.19 68.94,18.19 68.24,17.49 U4.5
$1N229610: length 2.3
  Top Layer w0.254: LED2.1 R7.2
$1N229612: length 4.1
  Top Layer w0.254: LED2.2 68.17,19.44 68.17,18.49 67.92,18.24 66.19,18.24 65.95,17.99 U4.1
$1N231307: length 1.8
  Top Layer w0.254: LED3.2 4.93,1.27 R4.2
$1N232666: length 34.4
  Top Layer w0.254: v3(70.71,7.92) 70.21,7.42 68.95,7.42 SW2.1
  Bottom Layer w0.254: R20.1 65.53,27.79 66.24,27.08 ; 66.24,27.08 66.24,21.74 66.75,21.23 67.46,21.23 69.39,19.3 69.39,14.48 70.71,13.16 v3(70.71,7.92) ; 66.24,27.08 66.24,30.28 65.28,31.24 61.32,31.24 Q1.4
$1N306233: length 3.9
  Top Layer w0.254: USB1.4 67.76,25.15 66.34,25.15 66.04,24.84 64.62,24.84 64.37,25.09 R22.2
$1N307750: length 3.8
  Top Layer w0.254: R23.1 65.32,28.41 65.56,28.17 USB1.10

## Copper pours and planes (outline as drawn; the poured copper is in the pictures)
GND on Top Layer: -0.86,33.58 74.57,33.58 74.57,-0.66 -0.86,-0.66
GND on Bottom Layer: 62.13,16.26 63.14,16.26 63.14,14.38 62.13,14.38
GND on Bottom Layer: 62.52,18.55 66.27,18.55 66.27,14.45 62.52,14.45
GND on Bottom Layer: 63.2,14.29 68.58,14.29 68.58,8.84 63.2,8.84
GND on Bottom Layer: -0.71,33.48 74.83,33.48 74.83,-1.17 -0.71,-1.17
GND on Bottom Layer: 67.27,8.89 68.22,8.89 68.22,1.94 67.27,1.94

Small or netless copper shapes (teardrops, artwork), in the pictures only: 163 on Top Layer, 71 on Bottom Layer

## Text on the board
Top Silkscreen Layer: 3V3 CLK DIO GND | B+B-A+A- VH LAT | 1 2 3 | CLKDI VH   PHE V | 4 5 6 | 调试按键 | 打印头 | 关 | 开 | 供电灯 | 状态灯 | 复位 / 按键 | + | -
